# EAGLE design GrblMainboard - v2.1 (EAGLE 6.3)
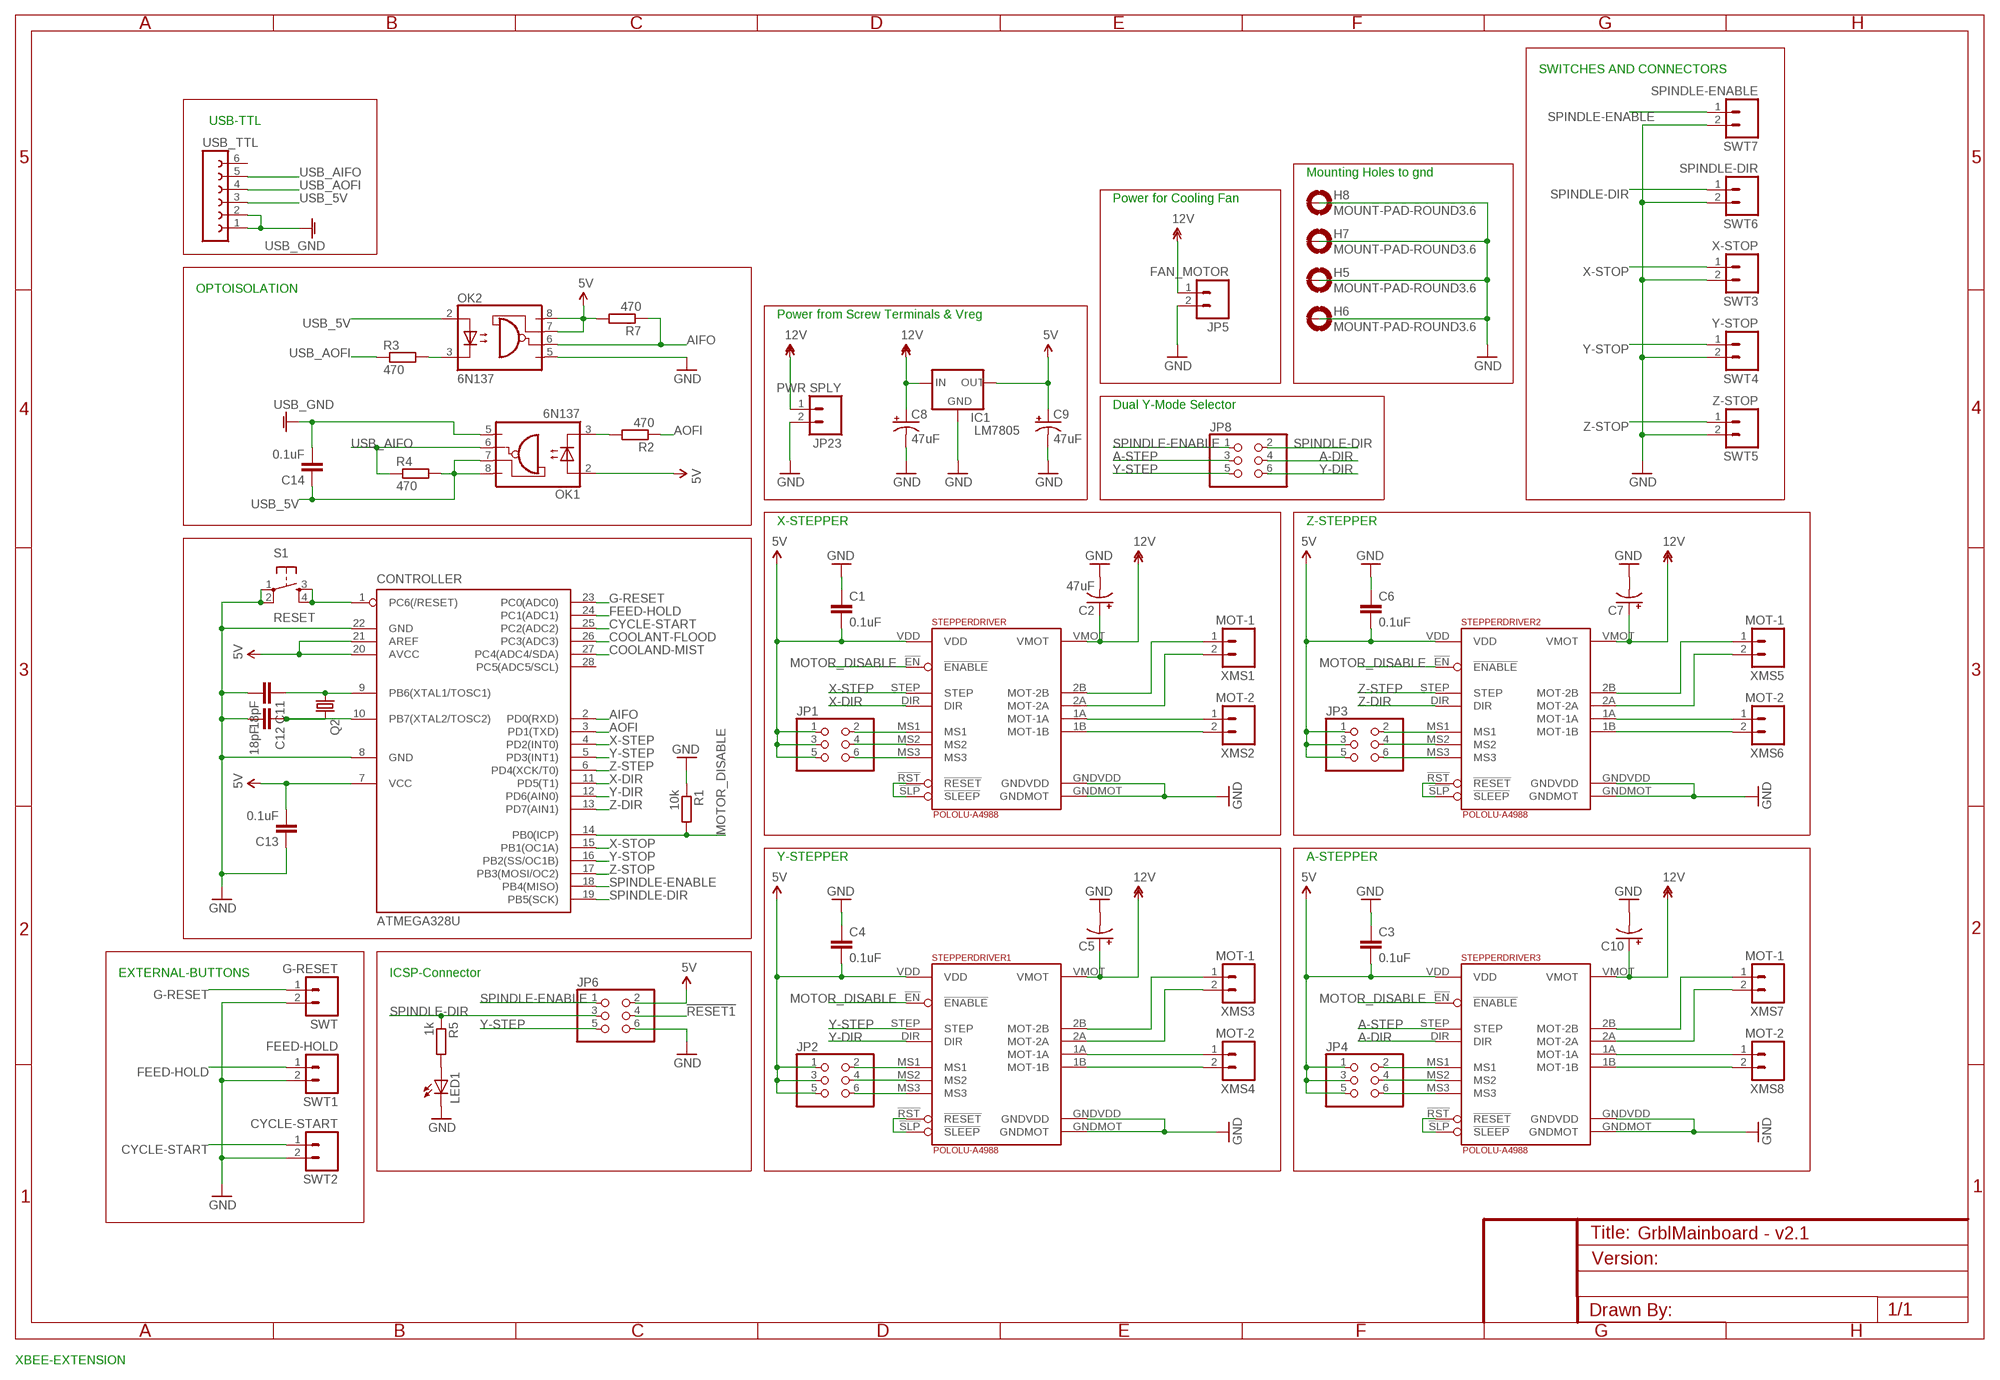
[diagram p0: schematic, sheet 1]

## Parts
ATMEGA328U  CONTROLLER  MEGA8-P  [DIL28-3]
C1  0.1uF  C-EU025-025X050  [C025-025X050]
C2  47uF  CPOL-USE2.5-6  [E2,5-6]
C3  0.1uF  C-EU025-025X050  [C025-025X050]
C4  0.1uF  C-EU025-025X050  [C025-025X050]
C5  CPOL-USE2.5-6  [E2,5-6]
C6  0.1uF  C-EU025-025X050  [C025-025X050]
C7  CPOL-USE2.5-6  [E2,5-6]
C8  47uF  CPOL-USE2.5-6  [E2,5-6]
C9  47uF  CPOL-USE2.5-6  [E2,5-6]
C10  CPOL-USE2.5-6  [E2,5-6]
C11  18pF  CAPPTH2  [CAP-PTH-SMALL2]
C12  18pF  CAPPTH2  [CAP-PTH-SMALL2]
C13  0.1uF  CAPPTH2  [CAP-PTH-SMALL2]
C14  0.1uF  CAPPTH2  [CAP-PTH-SMALL2]
H5  MOUNT-PAD-ROUND3.6  [3,6-PAD]
H6  MOUNT-PAD-ROUND3.6  [3,6-PAD]
H7  MOUNT-PAD-ROUND3.6  [3,6-PAD]
H8  MOUNT-PAD-ROUND3.6  [3,6-PAD]
IC1  LM7805  V_REG_78XX  [78XXL-CUSTOM]
JP1  PINHD-2X3  [2X03]
JP2  PINHD-2X3  [2X03]
JP3  PINHD-2X3  [2X03]
JP4  PINHD-2X3  [2X03]
JP5  FAN_MOTOR  M025MM  [SCREWTERMINAL-5MM-2]
JP6  PINHD-2X3  [2X03]
JP8  PINHD-2X3  [2X03]
JP23  PWR SPLY  M025MM  [SCREWTERMINAL-5MM-2]
LED1  LED5MM  [LED5MM]
OK1  6N137  [DIL08]
OK2  6N137  [DIL08]
Q2  CRYSTALHC49S  [HC49/S]
R1  10k  R-EU_0207/10  [0207/10]
R2  470  R-EU_0207/12  [0207/12]
R3  470  R-EU_0207/12  [0207/12]
R4  470  R-EU_0207/12  [0207/12]
R5  1k  R-EU_0207/10  [0207/10]
R7  470  R-EU_0207/12  [0207/12]
S1  RESET  TAC_SWITCHPTH  [TACTILE-PTH]
STEPPERDRIVER  POLOLU-A4988  POLOLU-ALLEGRO  [POLOLU-ALLEGRO-PTH]
STEPPERDRIVER1  POLOLU-A4988  POLOLU-ALLEGRO  [POLOLU-ALLEGRO-PTH]
STEPPERDRIVER2  POLOLU-A4988  POLOLU-ALLEGRO  [POLOLU-ALLEGRO-PTH]
STEPPERDRIVER3  POLOLU-A4988  POLOLU-ALLEGRO  [POLOLU-ALLEGRO-PTH]
SWT  G-RESET  M025MM  [SCREWTERMINAL-5MM-2]
SWT1  FEED-HOLD  M025MM  [SCREWTERMINAL-5MM-2]
SWT2  CYCLE-START  M025MM  [SCREWTERMINAL-5MM-2]
SWT3  X-STOP  M025MM  [SCREWTERMINAL-5MM-2]
SWT4  Y-STOP  M025MM  [SCREWTERMINAL-5MM-2]
SWT5  Z-STOP  M025MM  [SCREWTERMINAL-5MM-2]
SWT6  SPINDLE-DIR  M025MM  [SCREWTERMINAL-5MM-2]
SWT7  SPINDLE-ENABLE  M025MM  [SCREWTERMINAL-5MM-2]
USB_TTL  FE06-1  [FE06]
XMS1  MOT-1  M025MM  [SCREWTERMINAL-5MM-2]
XMS2  MOT-2  M025MM  [SCREWTERMINAL-5MM-2]
XMS3  MOT-1  M025MM  [SCREWTERMINAL-5MM-2]
XMS4  MOT-2  M025MM  [SCREWTERMINAL-5MM-2]
XMS5  MOT-1  M025MM  [SCREWTERMINAL-5MM-2]
XMS6  MOT-2  M025MM  [SCREWTERMINAL-5MM-2]
XMS7  MOT-1  M025MM  [SCREWTERMINAL-5MM-2]
XMS8  MOT-2  M025MM  [SCREWTERMINAL-5MM-2]

## Nets
5V: ATMEGA328U.7(VCC) ATMEGA328U.20(AVCC) ATMEGA328U.21(AREF) C1.2 C3.2 C4.2 C6.2 C9.+ C13.2 IC1.OUT JP1.1 JP1.3 JP1.5 JP2.1 JP2.3 JP2.5 JP3.1 JP3.3 JP3.5 JP4.1 JP4.3 JP4.5 JP6.2 OK1.2(A) OK2.7(VE) OK2.8(VCC) R7.2 STEPPERDRIVER1.VDD STEPPERDRIVER2.VDD STEPPERDRIVER3.VDD STEPPERDRIVER.VDD
12V: C2.+ C5.+ C7.+ C8.+ C10.+ IC1.IN JP5.1 JP23.1 STEPPERDRIVER1.VMOT STEPPERDRIVER2.VMOT STEPPERDRIVER3.VMOT STEPPERDRIVER.VMOT
!RESET1: ATMEGA328U.1(PC6(/RESET)) JP6.4 S1.3 S1.4
A-DIR: JP8.4 STEPPERDRIVER3.DIR
A-STEP: JP8.3 STEPPERDRIVER3.STEP
AIFO: ATMEGA328U.2(PD0(RXD)) OK2.6(VO) R7.1
AOFI: ATMEGA328U.3(PD1(TXD)) R2.1
COOLAND-MIST: ATMEGA328U.27(PC4(ADC4/SDA))
COOLANT-FLOOD: ATMEGA328U.26(PC3(ADC3))
CYCLE-START: ATMEGA328U.25(PC2(ADC2)) SWT2.1
FEED-HOLD: ATMEGA328U.24(PC1(ADC1)) SWT1.1
G-RESET: ATMEGA328U.23(PC0(ADC0)) SWT.1
GND: ATMEGA328U.8(GND) ATMEGA328U.22(GND) C1.1 C2.- C3.1 C4.1 C5.- C6.1 C7.- C8.- C9.- C10.- C11.2 C12.2 C13.1 IC1.GND JP5.2 JP6.6 JP23.2 LED1.K(C) OK2.5(GND) R1.1 S1.1 S1.2 STEPPERDRIVER1.GNDMOT STEPPERDRIVER1.GNDVDD STEPPERDRIVER2.GNDMOT STEPPERDRIVER2.GNDVDD STEPPERDRIVER3.GNDMOT STEPPERDRIVER3.GNDVDD STEPPERDRIVER.GNDMOT STEPPERDRIVER.GNDVDD SWT1.2 SWT2.2 SWT3.2 SWT4.2 SWT5.2 SWT6.2 SWT7.2 SWT.2
GNDA: C14.2 OK1.5(GND) USB_TTL.1 USB_TTL.2 ; supply symbol labelled USB_GND
MOTOR_DISABLE: ATMEGA328U.14(PB0(ICP)) R1.2 STEPPERDRIVER1.!EN(!ENABLE) STEPPERDRIVER2.!EN(!ENABLE) STEPPERDRIVER3.!EN(!ENABLE) STEPPERDRIVER.!EN(!ENABLE)
N$1: STEPPERDRIVER.2B(MOT-2B) XMS1.1
N$2: STEPPERDRIVER.2A(MOT-2A) XMS1.2
N$3: STEPPERDRIVER.1A(MOT-1A) XMS2.1
N$4: STEPPERDRIVER.1B(MOT-1B) XMS2.2
N$5: STEPPERDRIVER.!RST(!RESET) STEPPERDRIVER.!SLP(!SLEEP)
N$6: JP1.2 STEPPERDRIVER.MS1
N$7: JP1.4 STEPPERDRIVER.MS2
N$8: JP1.6 STEPPERDRIVER.MS3
N$9: STEPPERDRIVER1.2B(MOT-2B) XMS3.1
N$10: STEPPERDRIVER1.2A(MOT-2A) XMS3.2
N$11: STEPPERDRIVER1.1A(MOT-1A) XMS4.1
N$12: STEPPERDRIVER1.1B(MOT-1B) XMS4.2
N$13: STEPPERDRIVER1.!RST(!RESET) STEPPERDRIVER1.!SLP(!SLEEP)
N$14: JP2.2 STEPPERDRIVER1.MS1
N$15: JP2.4 STEPPERDRIVER1.MS2
N$16: JP2.6 STEPPERDRIVER1.MS3
N$17: STEPPERDRIVER2.2B(MOT-2B) XMS5.1
N$18: STEPPERDRIVER2.2A(MOT-2A) XMS5.2
N$19: STEPPERDRIVER2.1A(MOT-1A) XMS6.1
N$20: STEPPERDRIVER2.1B(MOT-1B) XMS6.2
N$21: STEPPERDRIVER2.!RST(!RESET) STEPPERDRIVER2.!SLP(!SLEEP)
N$22: JP3.2 STEPPERDRIVER2.MS1
N$23: JP3.4 STEPPERDRIVER2.MS2
N$24: JP3.6 STEPPERDRIVER2.MS3
N$25: STEPPERDRIVER3.2B(MOT-2B) XMS7.1
N$26: STEPPERDRIVER3.2A(MOT-2A) XMS7.2
N$27: STEPPERDRIVER3.1A(MOT-1A) XMS8.1
N$28: STEPPERDRIVER3.1B(MOT-1B) XMS8.2
N$29: STEPPERDRIVER3.!RST(!RESET) STEPPERDRIVER3.!SLP(!SLEEP)
N$30: JP4.2 STEPPERDRIVER3.MS1
N$31: JP4.4 STEPPERDRIVER3.MS2
N$32: JP4.6 STEPPERDRIVER3.MS3
N$33: ATMEGA328U.9(PB6(XTAL1/TOSC1)) C11.1 Q2.1
N$34: ATMEGA328U.10(PB7(XTAL2/TOSC2)) C12.1 Q2.2
N$35: OK2.3(C) R3.2
N$36: OK1.3(C) R2.2
N$37: LED1.A R5.2
SPINDLE-DIR: ATMEGA328U.19(PB5(SCK)) JP6.3 JP8.2 R5.1 SWT6.1
SPINDLE-ENABLE: ATMEGA328U.18(PB4(MISO)) JP6.1 JP8.1 SWT7.1
USB_5V: C14.1 OK1.7(VE) OK1.8(VCC) OK2.2(A) R4.2 USB_TTL.3
USB_AIFO: OK1.6(VO) R4.1 USB_TTL.5
USB_AOFI: R3.1 USB_TTL.4
X-DIR: ATMEGA328U.11(PD5(T1)) STEPPERDRIVER.DIR
X-STEP: ATMEGA328U.4(PD2(INT0)) STEPPERDRIVER.STEP
X-STOP: ATMEGA328U.15(PB1(OC1A)) SWT3.1
Y-DIR: ATMEGA328U.12(PD6(AIN0)) JP8.6 STEPPERDRIVER1.DIR
Y-STEP: ATMEGA328U.5(PD3(INT1)) JP6.5 JP8.5 STEPPERDRIVER1.STEP
Y-STOP: ATMEGA328U.16(PB2(SS/OC1B)) SWT4.1
Z-DIR: ATMEGA328U.13(PD7(AIN1)) STEPPERDRIVER2.DIR
Z-STEP: ATMEGA328U.6(PD4(XCK/T0)) STEPPERDRIVER2.STEP
Z-STOP: ATMEGA328U.17(PB3(MOSI/OC2)) SWT5.1
Unconnected: ATMEGA328U.28(PC5(ADC5/SCL)) H5.B3,6(MOUNT) H6.B3,6(MOUNT) H7.B3,6(MOUNT) H8.B3,6(MOUNT) USB_TTL.6

## Notes on the sheet
- SWITCHES AND CONNECTORS
- USB-TTL
- Mounting Holes to gnd
- Power for Cooling Fan
- OPTOISOLATION
- Power from Screw Terminals & Vreg
- Dual Y-Mode Selector
- X-STEPPER | Z-STEPPER
- Y-STEPPER | A-STEPPER
- EXTERNAL-BUTTONS | ICSP-Connector
- XBEE-EXTENSION

## Library data of the parts
ATMEGA328U = Bibsatmel:MEGA8-P: MICROCONTROLLER 8 Kbytes FLASH, 1 kbytes SRAM, 512 bytes EEPROM, USART, 4-channel 10 bit ADC, 2-channel 8 bit ADC Pin compatible with Atmega48, ATMega88, ATMega168 Source: avr.lbr; OC_FARNELL: unknown; OC_NEWARK: unknown
C1 C3 C4 C6 = resistor:C-EU: CAPACITOR, European symbol
C2 C5 C7-C10 = resistor:CPOL-US: POLARIZED CAPACITOR, American symbol
C11-C14 = SparkFun:CAP: Capacitor Standard 0603 ceramic capacitor, and 0.1" leaded capacitor.
H5-H8 = holes:MOUNT-PAD-ROUND: MOUNTING PAD, round
IC1 = SparkFun:V_REG_78XX: Voltage Regulator Standard 7805 5V regulator. IGO (Input Ground Output). Spark Fun Electronics SKU : COM-00107
JP1-JP4 JP6 JP8 = pinhead:PINHD-2X3: PIN HEADER
JP5 JP23 SWT SWT1-SWT7 XMS1-XMS8 = SparkFun:M02: Header 2 Standard 2-pin 0.1" header. Use with straight break away headers (SKU : PRT-00116), right angle break away headers (PRT-00553), swiss pins (PRT-00743), machine pins (PRT-00117), and female headers (PRT-00115). Molex polarized connector foot print use with SKU : PRT-08233 with associated crimp pins and housings.
LED1 = led:LED: LED OSRAM: - CHIPLED LG R971, LG N971, LY N971, LG Q971, LY Q971, LO R971, LY R971 LH N974, LH R974 LS Q976, LO Q976, LY Q976 LO Q996 - Hyper CHIPLED LW Q18S LB Q993, LB Q99A, LB R99A - SideLED LS A670, LO A670, LY A670, LG A670, LP A670 LB A673, LV A673, LT A673, LW A673 LH A674 LY A675 LS A676, LA A676, LO A676, LY A676, LW A676 LS A679, LY A679, LG A679 - Hyper Micro SIDELED® LS Y876, LA Y876, LO Y876, LY Y876 LT Y87S - SmartLED LW L88C, LW L88S LB L89C, LB L89S, LG L890 LS L89K, LO L89K, LY L89K LS L896, LA L896, LO L896, LY L896 - TOPLED LS T670, LO T670, LY T670, LG T670, LP T670 LSG T670, LSP T670, LSY T670, LOP T670, LYG T670 LG T671, LOG T671, LSG T671 LB T673, LV T673, LT T673, LW T673 LH T674 LS T676, LA T676, LO T676, LY T676, LB T676, LH T676, LSB T676, LW T676 LB T67C, LV T67C, LT T67C, LS T67K, LO T67K, LY T67K, LW E67C LS E67B, LA E67B, LO E67B, LY E67B, LB E67C, LV E67C, LT E67C LW T67C LS T679, LY T679, LG T679 LS T770, LO T770, LY T770, LG T770, LP T770 LB T773, LV T773, LT T773, LW T773 LH T774 LS E675, LA E675, LY E675, LS T675 LS T776, LA T776, LO T776, LY T776, LB T776 LHGB T686 LT T68C, LB T68C - Hyper Mini TOPLED® LB M676 - Mini TOPLED Santana® LG M470 LS M47K, LO M47K, LY M47K Source: http://www.osram.convergy.de LUXEON: - LUMILED® LXK2-PW12-R00, LXK2-PW12-S00, LXK2-PW14-U00, LXK2-PW14-V00 LXK2-PM12-R00, LXK2-PM12-S00, LXK2-PM14-U00 LXK2-PE12-Q00, LXK2-PE12-R00, LXK2-PE12-S00, LXK2-PE14-T00, LXK2-PE14-U00 LXK2-PB12-K00, LXK2-PB12-L00, LXK2-PB12-M00, LXK2-PB14-N00, LXK2-PB14-P00, LXK2-PB14-Q00 LXK2-PR12-L00, LXK2-PR12-M00, LXK2-PR14-Q00, LXK2-PR14-R00 LXK2-PD12-Q00, LXK2-PD12-R00, LXK2-PD12-S00 LXK2-PH12-R00, LXK2-PH12-S00 LXK2-PL12-P00, LXK2-PL12-Q00, LXK2-PL12-R00 Source: www.luxeon.com KINGBRIGHT: KA-3528ASYC Source: www.kingbright.com
OK1 OK2 = optocoupler:6N137: MOTOROLA OPTO COUPLER; MPN: 6N137; OC_FARNELL: 1328376; OC_NEWARK: 52M1895
Q2 = crystal:CRYSTAL: CRYSTAL; OC_FARNELL: 1667008; OC_NEWARK: unknown
R1-R5 R7 = resistor:R-EU_: RESISTOR, European symbol
S1 = SparkFun:TAC_SWITCH: Momentary Switch Button commonly used for reset or general input. Spark Fun Electronics SKU : COM-00097
STEPPERDRIVER STEPPERDRIVER1-STEPPERDRIVER3 = pololu-allegro:POLOLU-ALLEGRO
USB_TTL = con-lsta:FE06-1: FEMALE HEADER; OC_FARNELL: unknown; OC_NEWARK: unknown

## Board
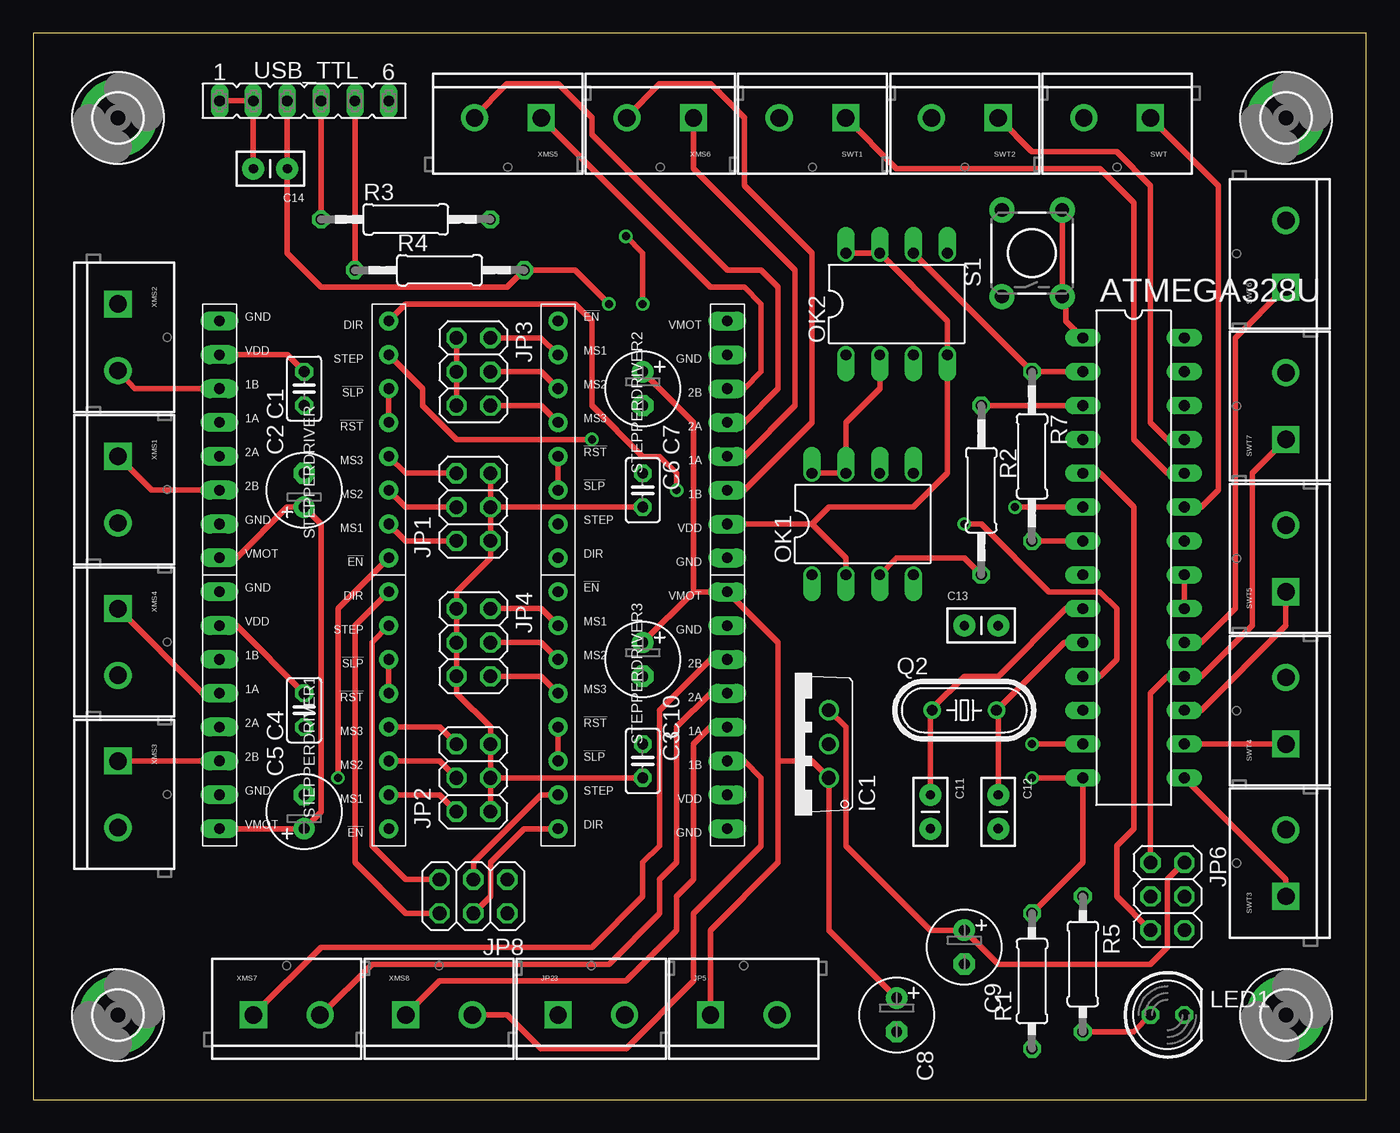
[diagram p1: board, top side]
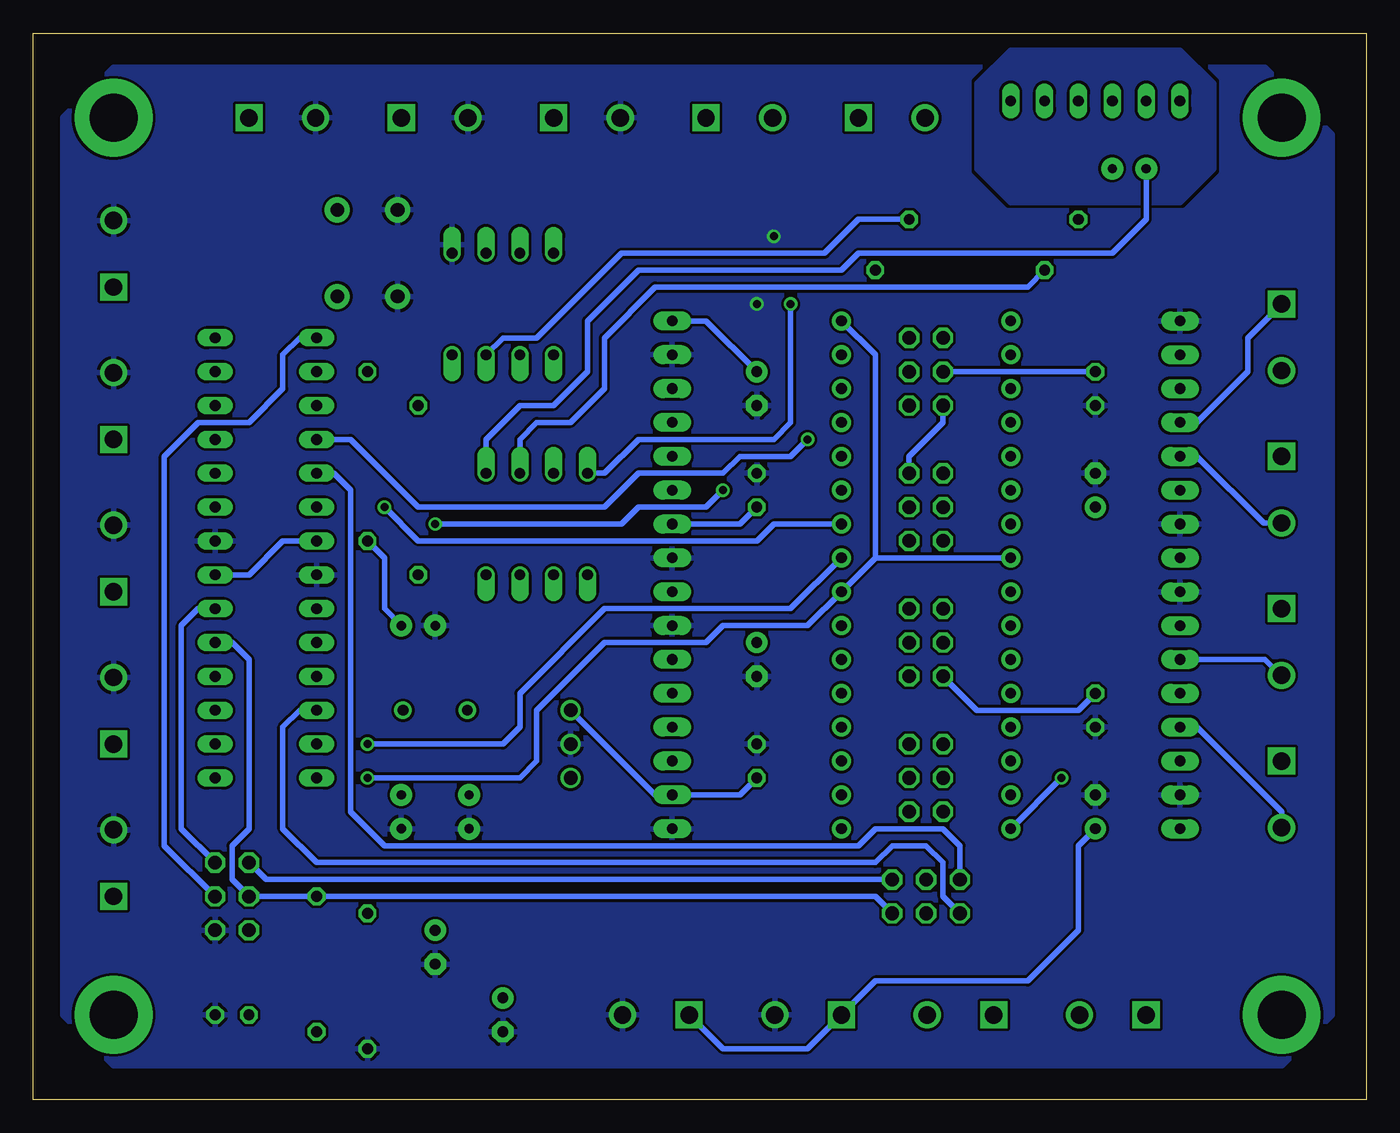
[diagram p2: board, bottom side, seen from below]

Size 100 x 80 mm. Coordinates in mm from the lower left corner, seen from the top.
Outline: 0,0 100,0 100,80 0,80 0,0
Copper layers (1*16): Top 0.035mm / dielectric 1.5mm / Bottom 0.035mm
Design rules "default": minimum track width 10mil, minimum drill 24mil, track to track 8mil, track to pad 8mil, pad to pad 8mil, via to via 8mil, smd to smd 8mil, copper to edge 40mil, drill to drill 8mil, minimum pad ring 10mil, minimum via ring 8mil, stop-mask expansion 4mil, vias tented up to drill 0mil, thermal gap 10mil

### Footprints (pad centres in the part's own frame; a part is rotated, then mirrored left to right if it is on the bottom)
DIL28-3 = drill 0.813 long: 1 -16.51,-3.81; 2 -13.97,-3.81; 3 -11.43,-3.81; 4 -8.89,-3.81; 5 -6.35,-3.81; 6 -3.81,-3.81; 7 -1.27,-3.81; 8 1.27,-3.81; 9 3.81,-3.81; 10 6.35,-3.81; 11 8.89,-3.81; 12 11.43,-3.81; 13 13.97,-3.81; 14 16.51,-3.81; 15 16.51,3.81; 16 13.97,3.81; 17 11.43,3.81; 18 8.89,3.81; 19 6.35,3.81; 20 3.81,3.81; 21 1.27,3.81; 22 -1.27,3.81; 23 -3.81,3.81; 24 -6.35,3.81; 25 -8.89,3.81; 26 -11.43,3.81; 27 -13.97,3.81; 28 -16.51,3.81
C025-025X050 = drill 0.813 octagon: 1 -1.27,0; 2 1.27,0
E2,5-6 = drill 0.813 pad 1.6: + -1.27,0 | drill 0.813 pad 1.6 octagon: - 1.27,0
CAP-PTH-SMALL2 = drill 0.7 pad 1.651: 1 0,0; 2 2.54,0
3,6-PAD = drill 3.6 pad 5.842: B3,6 0,0
78XXL-CUSTOM = drill 1.016: GND 0,0; IN -2.54,0; OUT 2.54,0
2X03 = drill 1.016 octagon: 1 -2.54,-1.27; 2 -2.54,1.27; 3 0,-1.27; 4 0,1.27; 5 2.54,-1.27; 6 2.54,1.27
SCREWTERMINAL-5MM-2 = drill 1.3 pad 2.032 square: 1 0,0 | drill 1.3 pad 2.032: 2 5,0
LED5MM = drill 0.813 octagon: A -1.27,0; K 1.27,0
DIL08 = drill 0.813 offset: 1 -3.81,-3.81; 2 -1.27,-3.81; 3 1.27,-3.81; 4 3.81,-3.81; 5 3.81,3.81; 6 1.27,3.81; 7 -1.27,3.81; 8 -3.81,3.81
HC49/S = drill 0.813: 1 -2.413,0; 2 2.413,0
0207/10 = drill 0.813 octagon: 1 -5.08,0; 2 5.08,0
0207/12 = drill 0.813 octagon: 1 -6.35,0; 2 6.35,0
TACTILE-PTH = drill 1.016 pad 1.88: 1 -3.251,2.261; 2 3.251,2.261; 3 -3.251,-2.261; 4 3.251,-2.261
POLOLU-ALLEGRO-PTH = drill 0.8 pad 1.422 long: 1A 6.35,-1.27; 1B 6.35,-3.81; 2A 6.35,1.27; 2B 6.35,3.81; GNDMOT 6.35,6.35; GNDVDD 6.35,-8.89; VDD 6.35,-6.35; VMOT 6.35,8.89 | drill 0.8 pad 1.422: !EN -6.35,8.89; !RST -6.35,-1.27; !SLP -6.35,-3.81; DIR -6.35,-8.89; MS1 -6.35,6.35; MS2 -6.35,3.81; MS3 -6.35,1.27; STEP -6.35,-6.35
FE06 = drill 0.813 long: 1 -6.35,0; 2 -3.81,0; 3 -1.27,0; 4 1.27,0; 5 3.81,0; 6 6.35,0

### Placement (x,y rotation side)
ATMEGA328U  82.55,40.64 270 top
C1  20.32,53.34 90 top
C2  20.32,45.72 90 top
C3  45.72,25.4 270 top
C4  20.32,29.21 90 top
C5  20.32,21.59 90 top
C6  45.72,45.72 270 top
C7  45.72,53.34 270 top
C8  64.77,6.35 270 top
C9  69.85,11.43 270 top
C10  45.72,33.02 270 top
C11  67.31,22.86 270 top
C12  72.39,22.86 270 top
C13  69.85,35.56 0 top
C14  19.05,69.85 180 top
H5  93.98,73.66 0 top
H6  6.35,6.35 0 top
H7  6.35,73.66 0 top
H8  93.98,6.35 0 top
IC1  59.69,26.67 90 top
JP1  33.02,44.45 90 top
JP2  33.02,24.13 90 top
JP3  33.02,54.61 270 top
JP4  33.02,34.29 270 top
JP5  50.8,6.35 0 top
JP6  85.09,15.24 270 top
JP8  33.02,15.24 180 top
JP23  39.37,6.35 0 top
LED1  85.09,6.35 0 top
OK1  62.23,43.18 0 top
OK2  64.77,59.69 0 top
Q2  69.85,29.21 0 top
R1  74.93,8.89 90 top
R2  71.12,45.72 270 top
R3  27.94,66.04 0 top
R4  30.48,62.23 0 top
R5  78.74,10.16 270 top
R7  74.93,48.26 270 top
S1  74.93,63.5 90 top
STEPPERDRIVER  20.32,49.53 180 top
STEPPERDRIVER1  20.32,29.21 180 top
STEPPERDRIVER2  45.72,49.53 0 top
STEPPERDRIVER3  45.72,29.21 0 top
SWT  83.82,73.66 180 top
SWT1  60.96,73.66 180 top
SWT2  72.39,73.66 180 top
SWT3  93.98,15.24 90 top
SWT4  93.98,26.67 90 top
SWT5  93.98,38.1 90 top
SWT6  93.98,60.96 90 top
SWT7  93.98,49.53 90 top
USB_TTL  20.32,74.93 0 top
XMS1  6.35,48.26 270 top
XMS2  6.35,59.69 270 top
XMS3  6.35,25.4 270 top
XMS4  6.35,36.83 270 top
XMS5  38.1,73.66 180 top
XMS6  49.53,73.66 180 top
XMS7  16.51,6.35 0 top
XMS8  27.94,6.35 0 top

### Tracks (layer width: path | path; a pad name or v marks a point on that pad's centre or on a via)
5V
  Top 0.406: JP2.3 JP2.5 34.29,27.94 31.75,30.48 JP4.5 JP4.3 JP4.1 31.75,38.1 34.29,40.64 JP1.1 JP1.3 | JP2.3 JP2.1 | JP1.3 JP1.5 | JP3.5 JP3.3 JP3.1 | ATMEGA328U.20 ATMEGA328U.21 | STEPPERDRIVER1.VDD 15.24,35.56 C4.2 | STEPPERDRIVER.VDD 19.05,55.88 C1.2 | C6.2 JP1.3 | IC1.OUT 60.96,27.94 60.96,19.05 67.31,12.7 C9.+ 72.39,10.16 83.82,10.16 85.09,11.43 85.09,16.51 JP6.2 | JP2.3 C3.2 | R7.2 ATMEGA328U.7 | STEPPERDRIVER2.VDD 58.42,43.18 | OK2.8 OK2.7 68.58,58.42 68.58,46.99 66.04,44.45 59.69,44.45 58.42,43.18 | OK1.2 60.96,40.64 58.42,43.18
  Bottom 0.406: JP1.5 34.29,48.26 31.75,50.8 JP3.5 | C3.2 46.99,22.86 STEPPERDRIVER3.VDD 53.34,22.86 IC1.OUT | STEPPERDRIVER2.VDD 46.99,43.18 C6.2 | JP6.2 88.9,20.32 88.9,35.56 87.63,36.83 ATMEGA328U.20 | ATMEGA328U.7 81.28,41.91 83.82,39.37 ATMEGA328U.21 | C13.2 73.66,36.83 73.66,40.64 R7.2 | C1.2 JP3.3 | C4.2 21.59,29.21 29.21,29.21 JP4.5
12V
  Top 0.406: STEPPERDRIVER1.VMOT C5.+ 21.59,21.59 21.59,43.18 C2.+ 19.05,44.45 15.24,40.64 STEPPERDRIVER.VMOT | C10.+ 49.53,38.1 | 49.53,38.1 STEPPERDRIVER3.VMOT 55.88,34.29 55.88,25.4 | JP5.1 50.8,12.7 55.88,17.78 55.88,25.4 | C8.+ 59.69,12.7 IC1.IN 58.42,25.4 55.88,25.4 | 49.53,38.1 49.53,50.8 C7.+
  Bottom 0.406: JP5.1 48.26,3.81 41.91,3.81 JP23.1 36.83,8.89 25.4,8.89 21.59,12.7 21.59,19.05 C5.+ | C7.+ 49.53,58.42 STEPPERDRIVER2.VMOT
!RESET1
  Top 0.406: S1.4 S1.3 77.47,59.97 77.47,58.42 ATMEGA328U.1
  Bottom 0.406: JP6.4 90.17,19.05 90.17,48.26 87.63,50.8 83.82,50.8 81.28,53.34 81.28,55.88 80.01,57.15 ATMEGA328U.1
A-DIR
  Top 0.406: JP8.4 34.29,15.24 34.29,17.78 36.83,20.32 STEPPERDRIVER3.DIR
A-STEP
  Top 0.406: JP8.3 33.02,17.78 38.1,22.86 STEPPERDRIVER3.STEP
AIFO
  Top 0.406: ATMEGA328U.2 R7.1 OK2.6
AOFI
  Top 0.406: ATMEGA328U.3 R2.1
CYCLE-START
  Top 0.406: ATMEGA328U.25 85.09,49.53 83.82,50.8 83.82,68.58 81.28,71.12 74.93,71.12 SWT2.1
FEED-HOLD
  Top 0.406: SWT1.1 64.77,69.85 80.01,69.85 82.55,67.31 82.55,49.53 85.09,46.99 ATMEGA328U.24
G-RESET
  Top 0.406: SWT.1 88.9,68.58 88.9,45.72 87.63,44.45 ATMEGA328U.23
GND  (via drill 0.6)
  Top 0.406: v45.72,59.69 45.72,63.5 v44.45,64.77
  pour Bottom (rank 2): 7.62,77.47 2.54,72.39 2.54,6.35 6.35,2.54 93.98,2.54 97.79,6.35 97.79,73.66 93.98,77.47
GNDA
  Top 0.406: USB_TTL.1 USB_TTL.2 C14.2
  Bottom 0.406: OK1.5 66.04,49.53 63.5,52.07 60.96,52.07 58.42,54.61 58.42,58.42 54.61,62.23 39.37,62.23 38.1,63.5 19.05,63.5 16.51,66.04 C14.2
MOTOR_DISABLE  (via drill 0.6)
  Top 0.406: R1.2 78.74,17.78 ATMEGA328U.14 v74.93,24.13 | STEPPERDRIVER.!EN 22.86,36.83 v22.86,24.13
  Bottom 0.406: v22.86,24.13 STEPPERDRIVER1.!EN | STEPPERDRIVER.!EN 36.83,40.64 | 36.83,40.64 STEPPERDRIVER3.!EN 41.91,35.56 48.26,35.56 49.53,34.29 57.15,34.29 62.23,29.21 62.23,25.4 63.5,24.13 v74.93,24.13 | 36.83,40.64 36.83,55.88 STEPPERDRIVER2.!EN
N$1
  Top 0.406: XMS1.1 8.89,45.72 STEPPERDRIVER.2B
N$2
  Bottom 0.406: XMS1.2 7.7,43.26 12.7,48.26 STEPPERDRIVER.2A
N$3
  Bottom 0.406: XMS2.1 8.89,57.15 8.89,54.61 12.7,50.8 STEPPERDRIVER.1A
N$4
  Top 0.406: XMS2.2 7.62,53.34 STEPPERDRIVER.1B
N$5
  Top 0.406: STEPPERDRIVER.!SLP STEPPERDRIVER.!RST
N$6
  Top 0.406: JP1.2 27.94,41.91 STEPPERDRIVER.MS1
N$7
  Top 0.406: JP1.4 27.94,44.45 STEPPERDRIVER.MS2
N$8
  Top 0.406: JP1.6 27.94,46.99 STEPPERDRIVER.MS3
N$9
  Top 0.406: XMS3.1 STEPPERDRIVER1.2B
N$10
  Bottom 0.406: XMS3.2 6.35,21.59 12.7,27.94 STEPPERDRIVER1.2A
N$11
  Top 0.406: XMS4.1 12.7,30.48 STEPPERDRIVER1.1A
N$12
  Bottom 0.406: 13.89,33.1 STEPPERDRIVER1.1B 7.62,33.02 6.43,31.83 XMS4.2
N$13
  Top 0.406: STEPPERDRIVER1.!RST STEPPERDRIVER1.!SLP
N$14
  Top 0.406: JP2.2 30.48,22.86 STEPPERDRIVER1.MS1
N$15
  Top 0.406: STEPPERDRIVER1.MS2 30.48,25.4 JP2.4
N$16
  Top 0.406: STEPPERDRIVER1.MS3 30.48,27.94 JP2.6
N$17
  Top 0.406: STEPPERDRIVER2.2B 53.34,53.34 54.61,54.61 54.61,59.69 53.34,60.96 50.8,60.96 XMS5.1
N$18
  Top 0.406: XMS5.2 33.1,73.74 35.56,76.2 39.37,76.2 41.91,73.66 41.91,72.39 52.07,62.23 54.61,62.23 55.88,60.96 55.88,53.34 53.34,50.8 STEPPERDRIVER2.2A
N$19
  Top 0.406: XMS6.1 49.53,69.85 57.15,62.23 57.15,52.07 53.34,48.26 STEPPERDRIVER2.1A
N$20
  Top 0.406: XMS6.2 44.53,73.74 46.99,76.2 50.8,76.2 53.34,73.66 53.34,68.58 58.42,63.5 58.42,50.8 53.34,45.72 STEPPERDRIVER2.1B
N$21
  Top 0.406: STEPPERDRIVER2.!RST STEPPERDRIVER2.!SLP
N$22
  Top 0.406: STEPPERDRIVER2.MS1 38.1,57.15 JP3.2
N$23
  Top 0.406: JP3.4 38.1,54.61 STEPPERDRIVER2.MS2
N$24
  Top 0.406: JP3.6 38.1,52.07 STEPPERDRIVER2.MS3
N$25
  Top 0.406: XMS7.1 21.59,11.43 41.91,11.43 45.72,15.24 45.72,17.78 46.99,19.05 46.99,29.21 50.8,33.02 STEPPERDRIVER3.2B
N$26
  Top 0.406: XMS7.2 21.59,6.35 25.4,10.16 43.18,10.16 46.99,13.97 46.99,16.51 48.26,17.78 48.26,27.94 50.8,30.48 STEPPERDRIVER3.2A
N$27
  Top 0.406: XMS8.1 30.48,8.89 44.45,8.89 48.26,12.7 48.26,15.24 49.53,16.51 49.53,26.67 50.8,27.94 STEPPERDRIVER3.1A
N$28
  Top 0.406: STEPPERDRIVER3.1B 53.34,25.4 54.61,24.13 54.61,19.05 49.53,13.97 49.53,8.89 44.45,3.81 38.1,3.81 35.56,6.35 XMS8.2
N$29
  Top 0.406: STEPPERDRIVER3.!RST STEPPERDRIVER3.!SLP
N$30
  Top 0.406: JP4.2 38.1,36.83 STEPPERDRIVER3.MS1
N$31
  Top 0.406: JP4.4 38.1,34.29 STEPPERDRIVER3.MS2
N$32
  Top 0.406: JP4.6 38.1,31.75 STEPPERDRIVER3.MS3
N$33
  Top 0.406: C11.1 67.31,29.08 Q2.1 67.44,29.34 69.85,31.75 72.39,31.75 77.47,36.83 ATMEGA328U.9
N$34
  Top 0.406: C12.1 72.39,29.08 Q2.2 77.34,34.29 ATMEGA328U.10
N$35
  Bottom 0.406: OK2.3 64.77,57.15 62.23,57.15 55.88,63.5 40.64,63.5 38.1,66.04 R3.2
N$36
  Top 0.406: OK1.3 64.77,40.64 69.85,40.64 R2.2
N$37
  Top 0.406: R5.2 82.55,5.08 LED1.A
SPINDLE-DIR
  Top 0.406: SWT6.1 90.17,57.15 90.17,36.83 87.63,34.29 ATMEGA328U.19
  Bottom 0.406: ATMEGA328U.19 85.09,34.29 83.82,33.02 83.82,20.32 85.09,19.05 85.09,16.51 JP6.3 R5.1 36.83,15.24 JP8.2
SPINDLE-ENABLE
  Top 0.406: SWT7.1 91.44,46.99 91.44,35.56 87.63,31.75 ATMEGA328U.18 85.09,31.75 83.82,30.48 JP6.1
  Bottom 0.406: JP8.1 82.55,16.51 JP6.1
USB_5V  (via drill 0.6)
  Top 0.406: OK2.2 63.5,53.34 60.96,50.8 OK1.7 OK1.8 | USB_TTL.3 C14.1 19.05,63.5 21.59,60.96 35.56,60.96 R4.2 40.64,62.23 v43.18,59.69
  Bottom 0.406: v43.18,59.69 43.18,50.8 44.45,49.53 54.61,49.53 57.15,46.99 OK1.8
USB_AIFO
  Top 0.406: USB_TTL.5 R4.1
  Bottom 0.406: OK1.6 63.5,49.53 62.23,50.8 59.69,50.8 57.15,53.34 57.15,57.15 53.34,60.96 25.4,60.96 R4.1
USB_AOFI
  Top 0.406: USB_TTL.4 R3.1
USB_GND
  pour Bottom: 26.67,78.74 29.21,76.2 29.21,69.85 26.67,67.31 13.97,67.31 11.43,69.85 11.43,76.2 13.97,78.74
X-DIR  (via drill 0.6)
  Top 0.406: STEPPERDRIVER.DIR 27.94,59.69 40.64,59.69 41.91,58.42 41.91,52.07 45.72,48.26 46.99,48.26 48.26,46.99 v48.26,45.72 | v69.85,43.18 71.12,43.18 76.2,38.1 80.01,38.1 81.28,36.83 81.28,33.02 80.01,31.75 ATMEGA328U.11
  Bottom 0.406: v48.26,45.72 49.53,44.45 54.61,44.45 55.88,43.18 v69.85,43.18
X-STEP  (via drill 0.6)
  Top 0.406: v41.91,49.53 31.75,49.53 29.21,52.07 29.21,53.34 STEPPERDRIVER.STEP
  Bottom 0.406: ATMEGA328U.4 76.2,49.53 71.12,44.45 57.15,44.45 54.61,46.99 48.26,46.99 46.99,48.26 43.18,48.26 v41.91,49.53
X-STOP
  Top 0.406: SWT3.1 93.98,16.51 ATMEGA328U.15
Y-DIR
  Top 0.406: JP8.6 27.94,13.97 24.13,17.78 24.13,35.56 STEPPERDRIVER1.DIR
  Bottom 0.406: JP8.6 31.75,15.24 31.75,17.78 33.02,19.05 35.56,19.05 36.83,17.78 78.74,17.78 81.28,20.32 81.28,27.94 80.01,29.21 ATMEGA328U.12
Y-STEP
  Top 0.406: STEPPERDRIVER1.STEP 25.4,34.29 25.4,19.05 27.94,16.51 JP8.5 | JP6.5 81.28,15.24 81.28,19.05 82.55,20.32 82.55,44.45 80.01,46.99 ATMEGA328U.5
  Bottom 0.406: JP8.5 30.48,19.05 31.75,20.32 36.83,20.32 38.1,19.05 73.66,19.05 76.2,21.59 76.2,45.72 77.47,46.99 ATMEGA328U.5
Y-STOP
  Top 0.406: SWT4.1 ATMEGA328U.16
Z-DIR  (via drill 0.6)
  Top 0.406: v74.93,26.67 ATMEGA328U.13
  Bottom 0.406: v74.93,26.67 64.77,26.67 63.5,27.94 63.5,30.48 57.15,36.83 43.18,36.83 STEPPERDRIVER2.DIR
Z-STEP  (via drill 0.6)
  Top 0.406: v73.66,44.45 ATMEGA328U.6
  Bottom 0.406: STEPPERDRIVER2.STEP 44.45,43.18 45.72,41.91 71.12,41.91 v73.66,44.45
Z-STOP
  Top 0.406: SWT5.1 93.98,35.56 87.63,29.21 ATMEGA328U.17